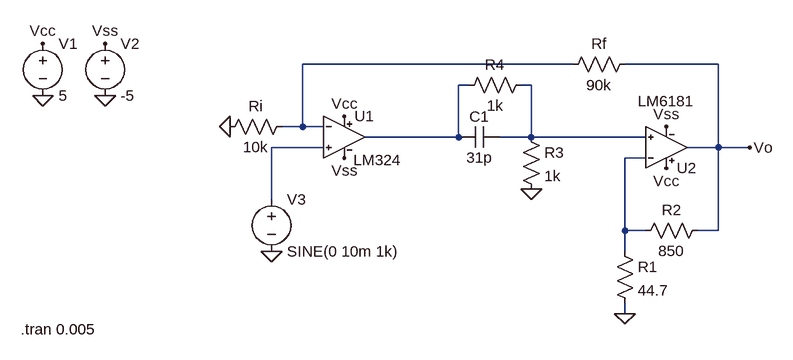
[diagram p0: schematic VFA-CFA_2.asc]
VFA-CFA_2.asc, the LTspice schematic file:
Version 4
SHEET 1 880 680
WIRE 304 32 -112 32
WIRE 528 32 384 32
WIRE 144 64 128 64
WIRE 240 64 224 64
WIRE -112 128 -112 32
WIRE -112 128 -144 128
WIRE -80 128 -112 128
WIRE 128 144 128 64
WIRE 128 144 -16 144
WIRE 240 144 240 64
WIRE 240 144 192 144
WIRE 416 144 240 144
WIRE -80 160 -160 160
WIRE 528 160 528 32
WIRE 528 160 480 160
WIRE 576 160 528 160
WIRE 416 176 384 176
WIRE -160 240 -160 160
WIRE 384 288 384 176
WIRE 416 288 384 288
WIRE 528 288 528 160
WIRE 528 288 496 288
WIRE 384 320 384 288
WIRE 384 416 384 400
FLAG 384 416 0
FLAG -224 128 0
FLAG -160 320 0
FLAG -512 80 0
FLAG -416 80 0
FLAG -512 0 Vcc
FLAG -48 112 Vcc
FLAG 448 192 Vcc
FLAG -416 0 Vss
FLAG -48 176 Vss
FLAG 448 128 Vss
FLAG 576 160 Vo
FLAG 240 224 0
SYMBOL AutoGenerated\\LM324 -48 144 R0
WINDOW 3 51 20 Top 2
SYMATTR InstName U1
SYMBOL res 368 304 R0
SYMATTR InstName R1
SYMATTR Value 44.7
SYMBOL res 512 272 R90
WINDOW 0 0 56 VBottom 2
WINDOW 3 32 56 VTop 2
SYMATTR InstName R2
SYMATTR Value 850
SYMBOL res 400 16 R90
WINDOW 0 0 56 VBottom 2
WINDOW 3 32 56 VTop 2
SYMATTR InstName Rf
SYMATTR Value 90k
SYMBOL res -128 112 R90
WINDOW 0 0 56 VBottom 2
WINDOW 3 32 56 VTop 2
SYMATTR InstName Ri
SYMATTR Value 10k
SYMBOL voltage -512 -16 R0
WINDOW 123 0 0 Left 0
WINDOW 39 0 0 Left 0
SYMATTR InstName V1
SYMATTR Value 5
SYMBOL voltage -416 -16 R0
WINDOW 123 0 0 Left 0
WINDOW 39 0 0 Left 0
SYMATTR InstName V2
SYMATTR Value -5
SYMBOL voltage -160 224 R0
WINDOW 123 0 0 Left 0
WINDOW 39 0 0 Left 0
SYMATTR InstName V3
SYMATTR Value SINE(0 10m 1k)
SYMBOL AutoGenerated\\LM6181 448 160 M180
SYMATTR InstName U2
SYMBOL cap 192 128 R90
WINDOW 0 0 32 VBottom 2
WINDOW 3 32 32 VTop 2
SYMATTR InstName C1
SYMATTR Value 31p
SYMBOL res 224 128 R0
SYMATTR InstName R3
SYMATTR Value 1k
SYMBOL res 240 48 R90
WINDOW 0 0 56 VBottom 2
WINDOW 3 32 56 VTop 2
SYMATTR InstName R4
SYMATTR Value 1k
TEXT -546 440 Left 2 !.tran 0.005

The netlist it stands for:
* VFA-CFA_2.asc
XU1 N004 N001 Vcc Vss N002 LM324  ; pins In+ In- V+ V- OUT
R1 N005 0 44.7
R2 Vo N005 850
Rf Vo N001 90k
Ri N001 0 10k
V1 Vcc 0 5
V2 Vss 0 -5
V3 N004 0 SINE(0 10m 1k)
XU2 N003 N005 Vcc Vss Vo LM6181  ; pins In+ In- V+ V- OUT
C1 N003 N002 31p
R3 N003 0 1k
R4 N003 N002 1k
.tran 0.005
.lib E:\LtSpice_components\LM324.ti.lib
.lib E:\LtSpice_components\LM6181.lib
.backanno
.end